# EAGLE design USB French Bar 2 (EAGLE 7.6.0)
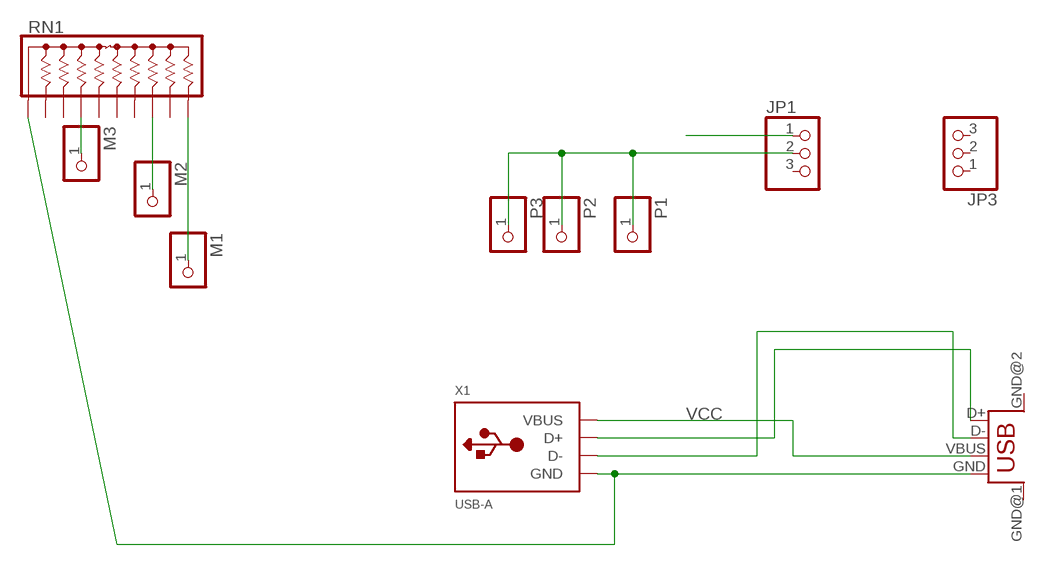
[diagram p0: schematic, sheet 1]

## Parts
JP1  PINHD-1X3  [1X03]
JP3  PINHD-1X3  [1X03]
M1  PINHD-1X1  [1X01]
M2  PINHD-1X1  [1X01]
M3  PINHD-1X1  [1X01]
P1  PINHD-1X1  [1X01]
P2  PINHD-1X1  [1X01]
P3  PINHD-1X1  [1X01]
RN1  4610X  [SIP10]
U$1  USB  [USB-FEMALE-A-PTH]
X1  USB-A  [MOLEX_480371000]

## Nets
N$1: RN1.1 U$1.GND X1.4(GND)
N$2: M1.1 RN1.10
N$3: U$1.D+ X1.3(D+)
N$4: U$1.D- X1.2(D-)
N$5: M2.1 RN1.8
N$6: M3.1 RN1.4
N$8: JP1.2 P1.1 P2.1 P3.1
VCC: JP1.1 U$1.VBUS X1.1(VBUS)
Unconnected: JP1.3 JP3.1 JP3.2 JP3.3 RN1.2 RN1.3 RN1.5 RN1.6 RN1.7 RN1.9 U$1.GND@1(GND) U$1.GND@2(GND)

## Library data of the parts
JP1 JP3 = adafruit:PINHD-1X3: PIN HEADER
M1-M3 P1-P3 = adafruit:PINHD-1X1: Pin header 1x1 for 0.1" spacing With round pins
RN1 = resistor-sip:4610X: Bourns 4600X Series - Thick Film Conformal SIPs 4610X-101 Resistor Network Configuration: 101 (Bussed Resistors) Resistance range: 10 ohms to 10 Megaohms Maximum Operating Voltage: 100V Source: http://www.bourns.com/ProductLine.aspx?name=standard_thick_film_networks PDF: http://www.bourns.com/data/global/pdfs/4600X.pdf
U$1 = STUNTAZ:USB: USB Connectors USB-FEMALE-A-PTH: Through hole Female Type A Connector
X1 = adafruit:USB-A: USB type A 'plug' Used for things that can directly connect to a USB port, say USB key

## Board
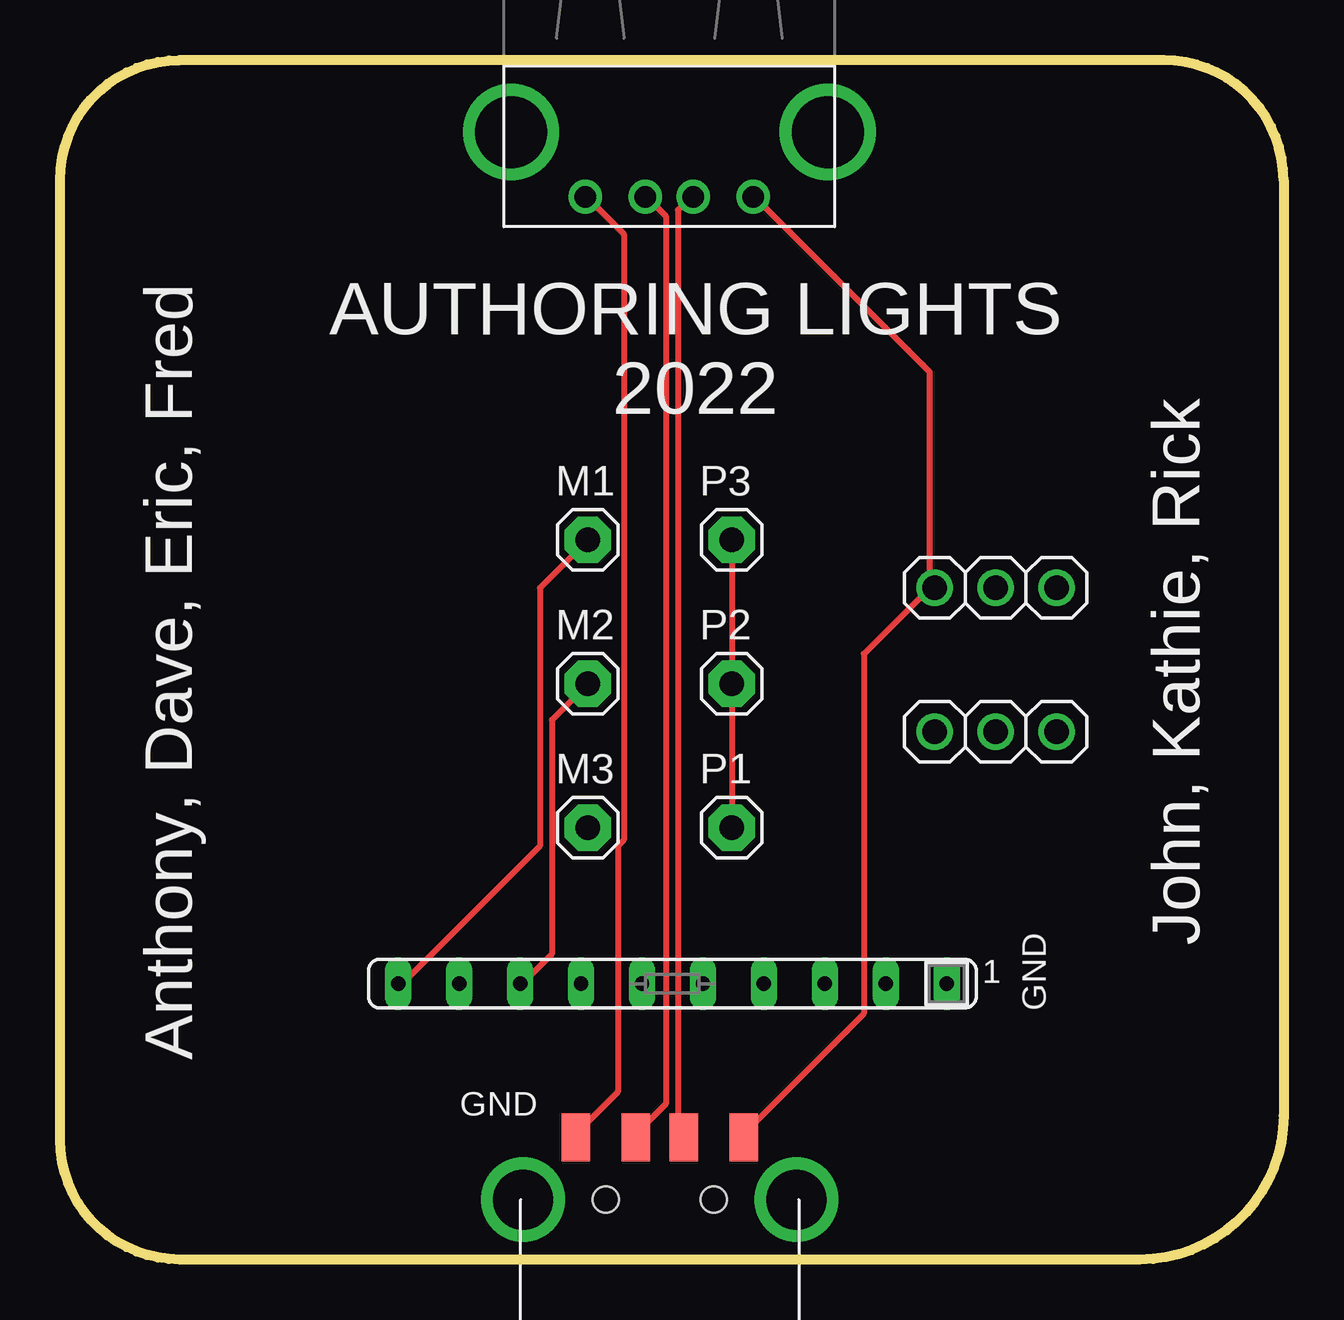
[diagram p1: board, top side]
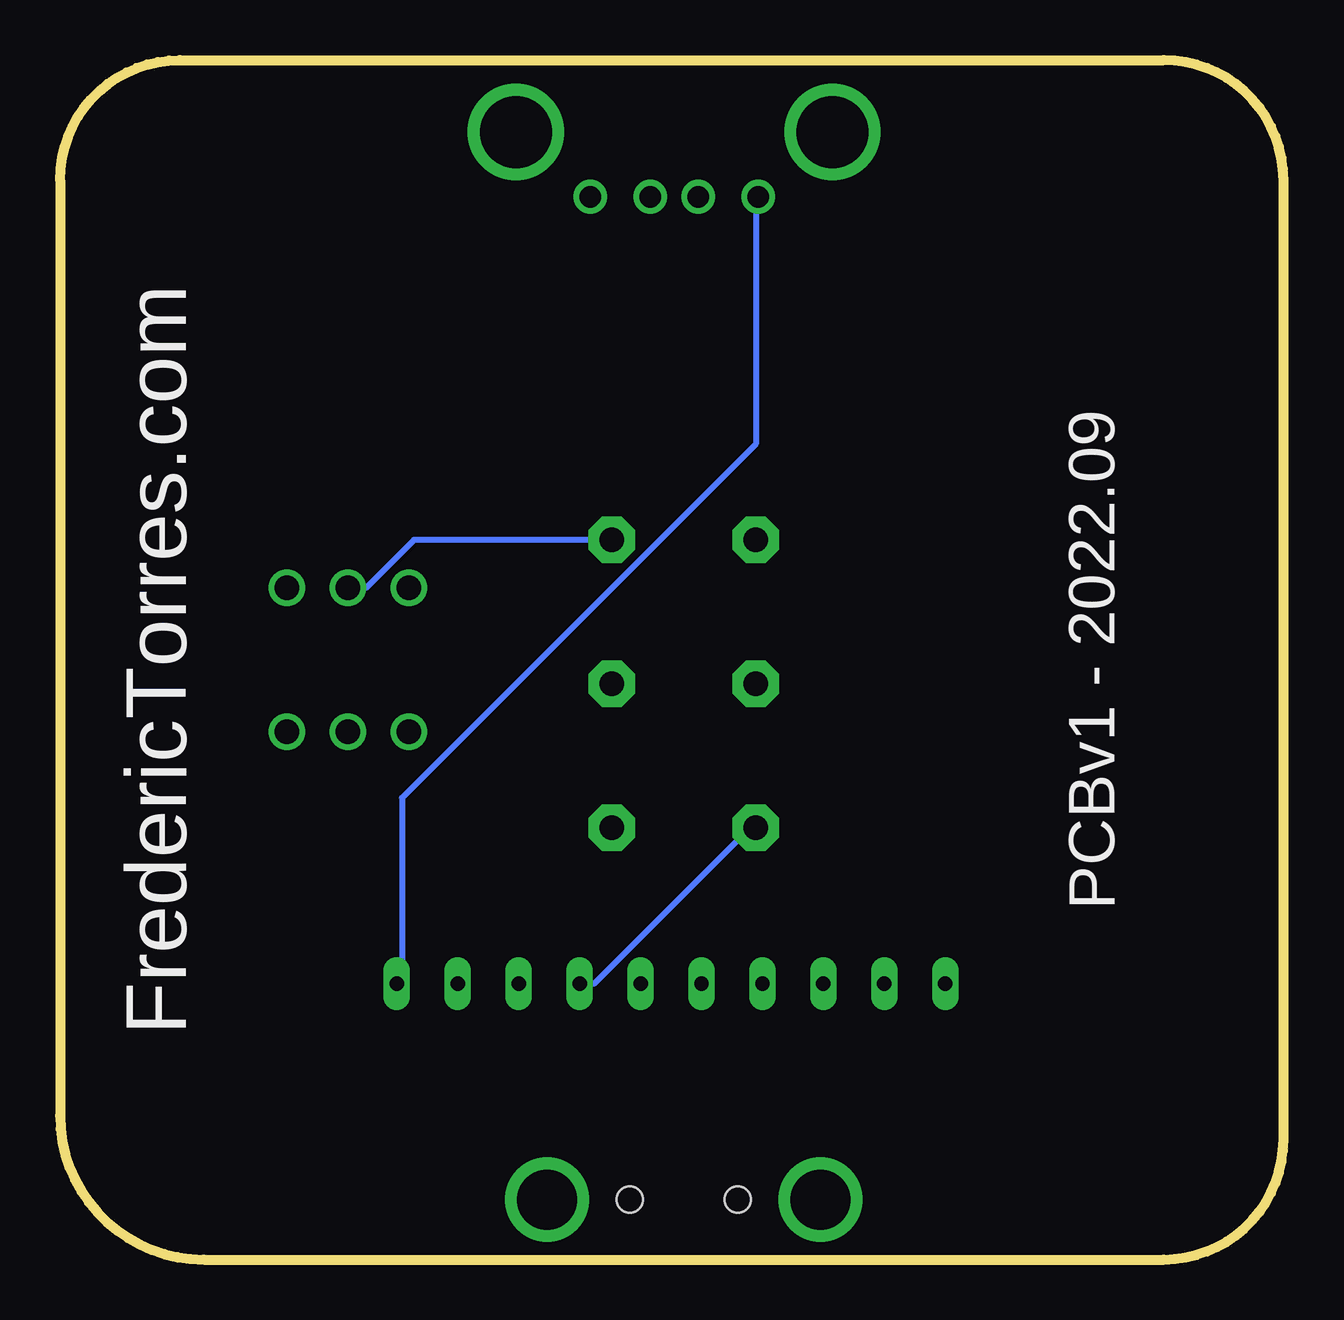
[diagram p2: board, bottom side, seen from below]

Size 51 x 50 mm. Coordinates in mm from the lower left corner, seen from the top.
Outline: 0,5 0,45 arc-90 5,50 46,50 arc-90 51,45 51,6 arc-90 45,0 5,0 arc-90 0,5
Copper layers (1*16): Top 0.035mm / dielectric 1.5mm / Bottom 0.035mm
Design rules "default": minimum track width 10mil, minimum drill 24mil, track to track 8mil, track to pad 8mil, pad to pad 8mil, via to via 8mil, smd to smd 8mil, copper to edge 40mil, drill to drill 8mil, minimum pad ring 10mil, minimum via ring 8mil, stop-mask expansion 4mil, vias tented up to drill 0mil, thermal gap 10mil

### Footprints (pad centres in the part's own frame; a part is rotated, then mirrored left to right if it is on the bottom)
1X03 = drill 1.016: 1 -2.54,0; 2 0,0; 3 2.54,0
1X01 = drill 1.016 pad 1.93 octagon: 1 0,0
SIP10 = drill 0.6 long: 1 -11.46,0; 2 -8.92,0; 3 -6.38,0; 4 -3.84,0; 5 -1.3,0; 6 1.24,0; 7 3.78,0; 8 6.32,0; 9 8.86,0; 10 11.4,0
USB-FEMALE-A-PTH = drill 0.9: D+ 5.9,1.3; D- 7.9,1.3; GND 3.4,1.3; VBUS 10.4,1.3 | drill 3: GND@1 13.5,4; GND@2 0.3,4
MOLEX_480371000 = smd 1.2 x 2: 1 3.5,2.6; 2 1,2.6; 3 -1,2.6; 4 -3.5,2.6 | drill 2.5: M1 -5.7,0; M2 5.7,0 | hole 1.1: -2.25,0; 2.25,0

### Placement (x,y rotation side)
JP1  39,28 0 top
JP3  39,22 0 top
M1  22,30 0 top
M2  22,24 0 top
M3  22,18 0 top
P1  28,18 0 top
P2  28,24 0 top
P3  28,30 0 top
RN1  25.5,11.5 180 top
U$1  18.5,43 0 top
X1  25,2.5 0 top

### Tracks (layer width: path | path; a pad name or v marks a point on that pad's centre or on a via)
N$1
  Top 0.254: X1.4 21.5,5.25 23.25,7 23.25,17.25 23.5,17.5 23.5,42.75 22,44.25 U$1.GND
  Bottom 0.254: RN1.1 36.75,11.5 36.75,19.25 22,34 22,44.25 U$1.GND
N$2
  Top 0.254: M1.1 20,28 20,17.25 14.25,11.5 RN1.10
N$3
  Top 0.254: X1.3 24,5.25 25.25,6.5 25.25,43.5 24.5,44.25 U$1.D+
N$4
  Top 0.254: X1.2 26,5.25 25.75,5.5 25.75,43.75 26.25,44.25 U$1.D-
N$5
  Top 0.254: M2.1 20.5,22.5 20.5,12.75 19.25,11.5 RN1.8
N$6
  Bottom 0.254: RN1.4 28.75,11.5 22.25,18 M3.1
N$8
  Top 0.254: P1.1 P2.1 P3.1
  Bottom 0.254: JP1.2 38.25,28 36.25,30 P3.1
VCC
  Top 0.254: 36.25,28 33.5,25.25 33.5,10.25 28.5,5.25 X1.1 | 36.25,28 36.25,37 29,44.25 U$1.VBUS | 36.25,28 JP1.1

### Text on the board
tNames: AUTHORING LIGHTS / 2022 | Anthony, Dave, Eric, Fred | John, Kathie, Rick | GND | GND
bNames: PCBv1 - 2022.09 | FredericTorres.com